# Altium schematic sheet USB.SchDoc
size A4; SheetNumber: 6; SheetTotal: 7
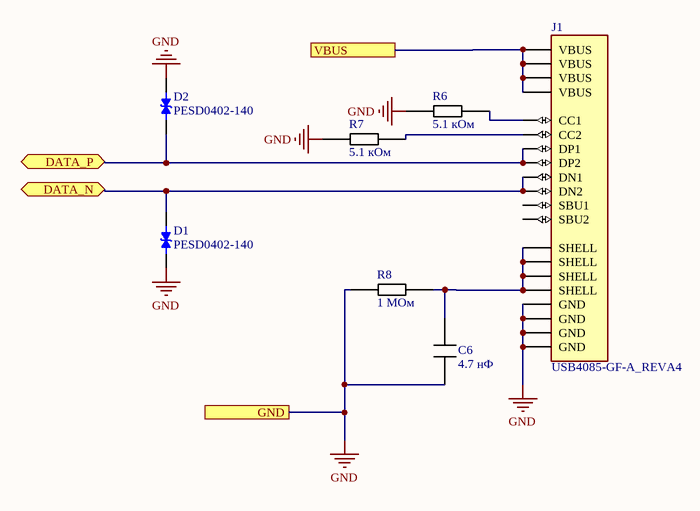
[diagram p0: USB.SchDoc]

## Parts
C6  4.7 нФ  [WURTH 885012206012]
D1  PESD0402-140  [DIO_PESD0402-140]
D2  PESD0402-140  [DIO_PESD0402-140]
J1  USB4085-GF-A_REVA4  [GCT_USB4085-GF-A_REVA4]
R6  5.1 кОм  [RC0805FR-075K1L]
R7  5.1 кОм  [RC0805FR-075K1L]
R8  1 МОм  [RC0805FR-071ML]

## Ports
DATA_N (bidir, see TOP_LEVEL[4C], MODULES[4A]), DATA_P (bidir, see TOP_LEVEL[4C], MODULES[3A]), GND (see TOP_LEVEL[4C], FLASH[3C], MODULES[2D], NFC[2C], POWER_IN[3C], SWD[2B]), VBUS (see TOP_LEVEL[4C], MODULES[2B])

## Nets
GND: C6.1 D1.2 D2.2 J1.A1(GND) J1.A12(GND) J1.B1(GND) J1.B12(GND) R6.1 R7.2 R8.1 ; port GND
DATA_N: D1.1 J1.A7(DN1) J1.B7(DN2) ; port DATA_N
DATA_P: D2.1 J1.A6(DP1) J1.B6(DP2) ; port DATA_P
VBUS: J1.A4(VBUS) J1.A9(VBUS) J1.B4(VBUS) J1.B9(VBUS) ; port VBUS
NetC6_2: C6.2 J1.S1(SHELL) J1.S2(SHELL) J1.S3(SHELL) J1.S4(SHELL) R8.2
NetJ1_A5: J1.A5(CC1) R6.2
NetJ1_B5: J1.B5(CC2) R7.1

Not connected (* = marked no-connect by the designer): J1 A8(SBU1) B8(SBU2)

## Library data of the parts
C6 = WURTH 885012206012
D1 D2 = PESD0402-140: 40V Clamp - Ipp Tvs Diode Surface Mount 0402; MF: Littelfuse Inc.; SnapEDA_Link: https://www.snapeda.com/parts/PESD0402-140/Littelfuse/view-part/?ref=snap; Package: 0402 Littelfuse Inc.; Value: *; MP: PESD0402-140; Check_prices: https://www.snapeda.com/parts/PESD0402-140/Littelfuse/view-part/?ref=eda
J1 = USB4085-GF-A_REVA4: USB-C (USB TYPE-C) USB 2.0 Receptacle Connector 24 (16+8 Dummy) Position Through Hole, Right Angle, low cost, 3.46mm profile, 16 pin, horizontal, Top mount; MF: Global Connector Technology; SnapEDA_Link: https://www.snapeda.com/parts/USB4085-GF-A/Global+Connector+Technology/view-part/?ref=snap; Package: None; MP: USB4085-GF-A; Check_prices: https://www.snapeda.com/parts/USB4085-GF-A/Global+Connector+Technology/view-part/?ref=eda; Purchase-URL: https://pricing.snapeda.com/search/part/USB4085-GF-A/?ref=eda; Price: None; Value: *; Availability: In Stock
R6 R7 = RC0805FR-075K1L
R8 = RC0805FR-071ML